# Altium schematic sheet Controller_Schematic.SchDoc
size A3; SheetNumber: 3; SheetTotal: 3
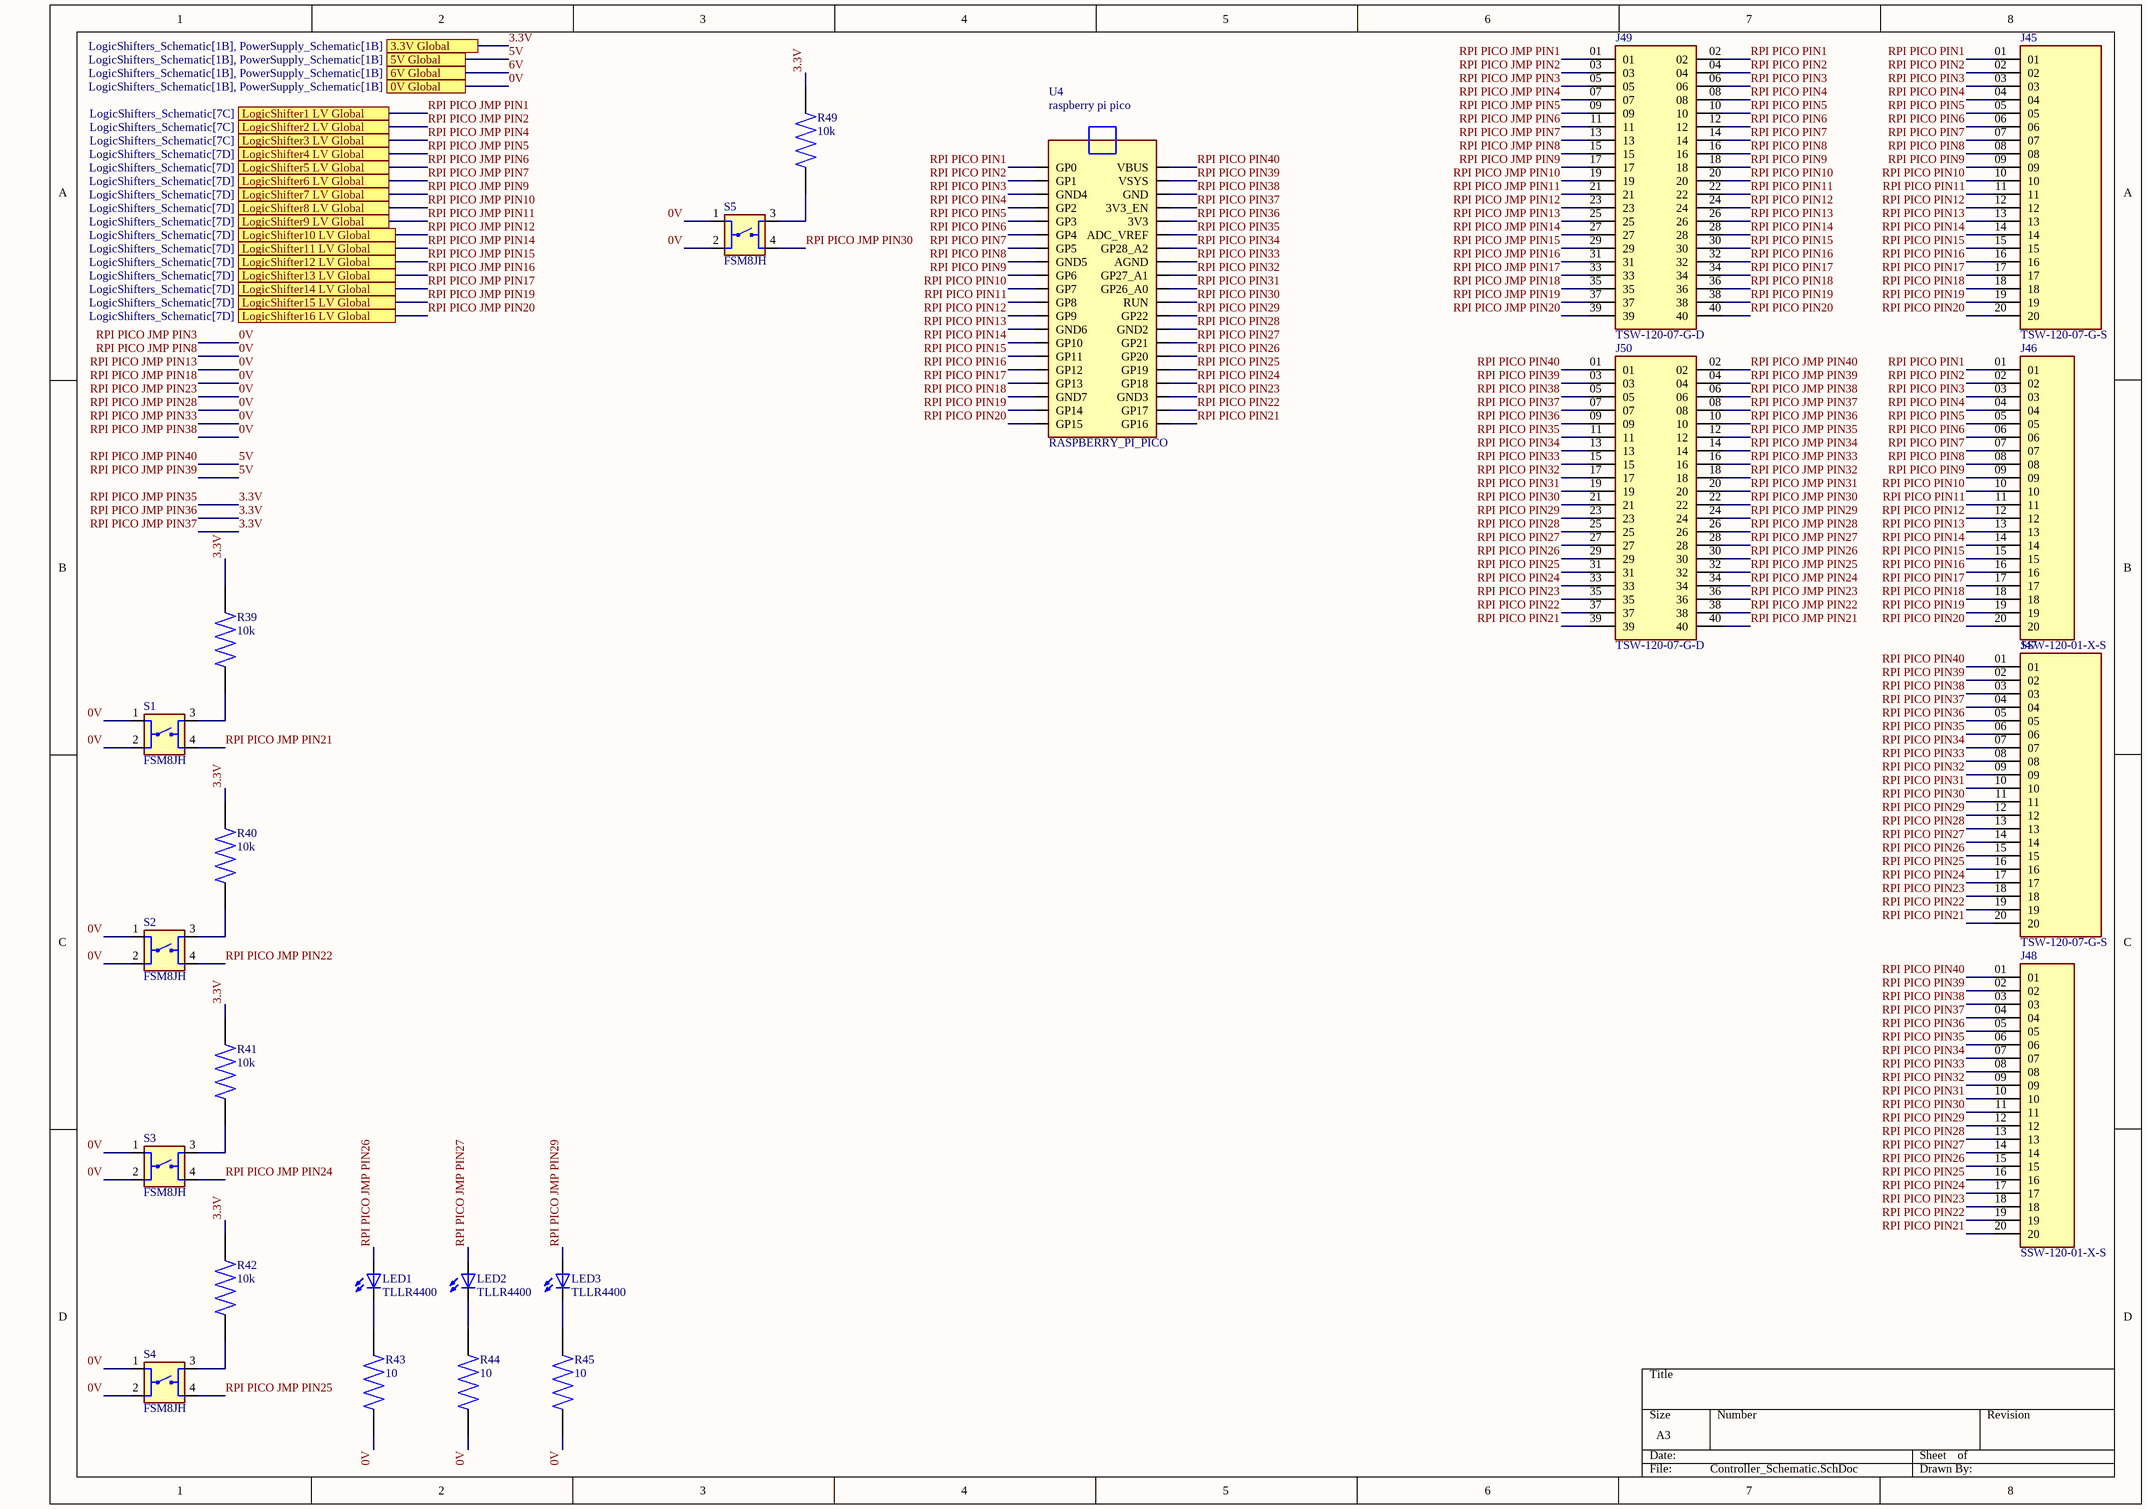
[diagram p0: Controller_Schematic.SchDoc]

## Parts
J45  TSW-120-07-G-S  [SAMTEC_TSW-120-07-G-S]
J46  SSW-120-01-X-S  [SAMTEC_SSW-120-01-X-S]
J47  TSW-120-07-G-S  [SAMTEC_TSW-120-07-G-S]
J48  SSW-120-01-X-S  [SAMTEC_SSW-120-01-X-S]
J49  TSW-120-07-G-D  [SAMTEC_TSW-120-07-G-D]
J50  TSW-120-07-G-D  [SAMTEC_TSW-120-07-G-D]
LED1  TLLR4400  [LED3MM]
LED2  TLLR4400  [LED3MM]
LED3  TLLR4400  [LED3MM]
R39  10k  [RESAD700W45L350D185]
R40  10k  [RESAD700W45L350D185]
R41  10k  [RESAD700W45L350D185]
R42  10k  [RESAD700W45L350D185]
R43  10  [RESAD700W45L350D185]
R44  10  [RESAD700W45L350D185]
R45  10  [RESAD700W45L350D185]
R49  10k  [RESAD700W45L350D185]
S1  FSM8JH  [SW_FSM8JH]
S2  FSM8JH  [SW_FSM8JH]
S3  FSM8JH  [SW_FSM8JH]
S4  FSM8JH  [SW_FSM8JH]
S5  FSM8JH  [SW_FSM8JH]
U4  RASPBERRY_PI_PICO  [RASPBERRY_PI_PICO]

## Ports
0V Global (see LogicShifters_Schematic[1B], PowerSupply_Schematic[1B]), 3.3V Global (see LogicShifters_Schematic[1B], PowerSupply_Schematic[1B]), 5V Global (see LogicShifters_Schematic[1B], PowerSupply_Schematic[1B]), 6V Global (see LogicShifters_Schematic[1B], PowerSupply_Schematic[1B]), LogicShifter1 LV Global (see LogicShifters_Schematic[7C]), LogicShifter2 LV Global (see LogicShifters_Schematic[7C]), LogicShifter3 LV Global (see LogicShifters_Schematic[7C]), LogicShifter4 LV Global (see LogicShifters_Schematic[7D]), LogicShifter5 LV Global (see LogicShifters_Schematic[7D]), LogicShifter6 LV Global (see LogicShifters_Schematic[7D]), LogicShifter7 LV Global (see LogicShifters_Schematic[7D]), LogicShifter8 LV Global (see LogicShifters_Schematic[7D]), LogicShifter9 LV Global (see LogicShifters_Schematic[7D]), LogicShifter10 LV Global (see LogicShifters_Schematic[7D]), LogicShifter11 LV Global (see LogicShifters_Schematic[7D]), LogicShifter12 LV Global (see LogicShifters_Schematic[7D]), LogicShifter13 LV Global (see LogicShifters_Schematic[7D]), LogicShifter14 LV Global (see LogicShifters_Schematic[7D]), LogicShifter15 LV Global (see LogicShifters_Schematic[7D]), LogicShifter16 LV Global (see LogicShifters_Schematic[7D])

## Nets
0V: J49.05 J49.15 J49.25 J49.35 J50.06 J50.16 J50.26 J50.36 R43.1 R44.1 R45.1 S1.1 S1.2 S2.1 S2.2 S3.1 S3.2 S4.1 S4.2 S5.1 S5.2 ; port 0V Global  [also labelled RPI PICO JMP PIN13, RPI PICO JMP PIN18, RPI PICO JMP PIN23, RPI PICO JMP PIN28, RPI PICO JMP PIN3, RPI PICO JMP PIN33, RPI PICO JMP PIN38, RPI PICO JMP PIN8]
3.3V: J50.08 J50.10 J50.12 R39.2 R40.2 R41.2 R42.2 R49.2 ; port 3.3V Global  [also labelled RPI PICO JMP PIN35, RPI PICO JMP PIN36, RPI PICO JMP PIN37]
5V: J50.02 J50.04 ; port 5V Global  [also labelled RPI PICO JMP PIN39, RPI PICO JMP PIN40]
6V: port 6V Global
RPI PICO JMP PIN1: J49.01 ; port LogicShifter1 LV Global
RPI PICO JMP PIN2: J49.03 ; port LogicShifter2 LV Global
RPI PICO JMP PIN4: J49.07 ; port LogicShifter3 LV Global
RPI PICO JMP PIN5: J49.09 ; port LogicShifter4 LV Global
RPI PICO JMP PIN6: J49.11 ; port LogicShifter5 LV Global
RPI PICO JMP PIN7: J49.13 ; port LogicShifter6 LV Global
RPI PICO JMP PIN9: J49.17 ; port LogicShifter7 LV Global
RPI PICO JMP PIN10: J49.19 ; port LogicShifter8 LV Global
RPI PICO JMP PIN11: J49.21 ; port LogicShifter9 LV Global
RPI PICO JMP PIN12: J49.23 ; port LogicShifter10 LV Global
RPI PICO JMP PIN14: J49.27 ; port LogicShifter11 LV Global
RPI PICO JMP PIN15: J49.29 ; port LogicShifter12 LV Global
RPI PICO JMP PIN16: J49.31 ; port LogicShifter13 LV Global
RPI PICO JMP PIN17: J49.33 ; port LogicShifter14 LV Global
RPI PICO JMP PIN19: J49.37 ; port LogicShifter15 LV Global
RPI PICO JMP PIN20: J49.39 ; port LogicShifter16 LV Global
RPI PICO JMP PIN21: J50.40 S1.4
RPI PICO JMP PIN22: J50.38 S2.4
RPI PICO JMP PIN24: J50.34 S3.4
RPI PICO JMP PIN25: J50.32 S4.4
RPI PICO JMP PIN26: J50.30 LED1.A
RPI PICO JMP PIN27: J50.28 LED2.A
RPI PICO JMP PIN29: J50.24 LED3.A
RPI PICO JMP PIN30: J50.22 S5.4
RPI PICO JMP PIN31: J50.20
RPI PICO JMP PIN32: J50.18
RPI PICO JMP PIN34: J50.14
RPI PICO PIN1: J45.01 J46.01 J49.02 U4.GP0
RPI PICO PIN2: J45.02 J46.02 J49.04 U4.GP1
RPI PICO PIN3: J45.03 J46.03 J49.06 U4.GND4
RPI PICO PIN4: J45.04 J46.04 J49.08 U4.GP2
RPI PICO PIN5: J45.05 J46.05 J49.10 U4.GP3
RPI PICO PIN6: J45.06 J46.06 J49.12 U4.GP4
RPI PICO PIN7: J45.07 J46.07 J49.14 U4.GP5
RPI PICO PIN8: J45.08 J46.08 J49.16 U4.GND5
RPI PICO PIN9: J45.09 J46.09 J49.18 U4.GP6
RPI PICO PIN10: J45.10 J46.10 J49.20 U4.GP7
RPI PICO PIN11: J45.11 J46.11 J49.22 U4.GP8
RPI PICO PIN12: J45.12 J46.12 J49.24 U4.GP9
RPI PICO PIN13: J45.13 J46.13 J49.26 U4.GND6
RPI PICO PIN14: J45.14 J46.14 J49.28 U4.GP10
RPI PICO PIN15: J45.15 J46.15 J49.30 U4.GP11
RPI PICO PIN16: J45.16 J46.16 J49.32 U4.GP12
RPI PICO PIN17: J45.17 J46.17 J49.34 U4.GP13
RPI PICO PIN18: J45.18 J46.18 J49.36 U4.GND7
RPI PICO PIN19: J45.19 J46.19 J49.38 U4.GP14
RPI PICO PIN20: J45.20 J46.20 J49.40 U4.GP15
RPI PICO PIN21: J47.20 J48.20 J50.39 U4.GP16
RPI PICO PIN22: J47.19 J48.19 J50.37 U4.GP17
RPI PICO PIN23: J47.18 J48.18 J50.35 U4.GND3
RPI PICO PIN24: J47.17 J48.17 J50.33 U4.GP18
RPI PICO PIN25: J47.16 J48.16 J50.31 U4.GP19
RPI PICO PIN26: J47.15 J48.15 J50.29 U4.GP20
RPI PICO PIN27: J47.14 J48.14 J50.27 U4.GP21
RPI PICO PIN28: J47.13 J48.13 J50.25 U4.GND2
RPI PICO PIN29: J47.12 J48.12 J50.23 U4.GP22
RPI PICO PIN30: J47.11 J48.11 J50.21 U4.RUN
RPI PICO PIN31: J47.10 J48.10 J50.19 U4.GP26_A0
RPI PICO PIN32: J47.09 J48.09 J50.17 U4.GP27_A1
RPI PICO PIN33: J47.08 J48.08 J50.15 U4.AGND
RPI PICO PIN34: J47.07 J48.07 J50.13 U4.GP28_A2
RPI PICO PIN35: J47.06 J48.06 J50.11 U4.ADC_VREF
RPI PICO PIN36: J47.05 J48.05 J50.09 U4.3V3
RPI PICO PIN37: J47.04 J48.04 J50.07 U4.3V3_EN
RPI PICO PIN38: J47.03 J48.03 J50.05 U4.GND
RPI PICO PIN39: J47.02 J48.02 J50.03 U4.VSYS
RPI PICO PIN40: J47.01 J48.01 J50.01 U4.VBUS
NetLED1_K: LED1.K(C) R43.2
NetLED2_K: LED2.K(C) R44.2
NetLED3_K: LED3.K(C) R45.2
NetR39_1: R39.1 S1.3
NetR40_1: R40.1 S2.3
NetR41_1: R41.1 S3.3
NetR42_1: R42.1 S4.3
NetR49_1: R49.1 S5.3

## Notes on the sheet
- (in symbol RASPBERRY_PI_PICO) raspberry pi pico

## Library data of the parts
J45 J47 = TSW-120-07-G-S: MF: Samtec; Package: None; MP: TSW-120-07-G-S; Price: None; Value: *; Availability: Unavailable
J46 J48 = SSW-120-01-X-S: SSW - Samtec 2.54mm Single Row Straight Socket Strip 8.5 Profile - Fast Stock; MP: SSW-120-01-G-S; SnapEDA_Link: https://www.snapeda.com/parts/SSW-120-01-G-S/Samtec/view-part/?ref=snap; Package: None; Value: *; MF: Samtec; Check_prices: https://www.snapeda.com/parts/SSW-120-01-G-S/Samtec/view-part/?ref=eda
J49 J50 = TSW-120-07-G-D: MF: Samtec; Price: None; Value: *; Availability: Unavailable; MP: TSW-120-07-G-D; Package: None
LED1-LED3 = TLLR4400: Red 619nm LED Indication - Discrete 1.9V Radial; MF: Vishay; SnapEDA_Link: https://www.snapeda.com/parts/TLLR4400/Vishay+Semiconductor+Opto+Division/view-part/?ref=snap; Package: None; Value: *; MP: TLLR4400; Check_prices: https://www.snapeda.com/parts/TLLR4400/Vishay+Semiconductor+Opto+Division/view-part/?ref=eda
R39-R45 R49 = 3-1623927-1: 1 MOhms Â±5% 0.25W, 1/4W Through Hole Resistor Axial - Carbon Film; MF: TE Connectivity; SnapEDA_Link: https://www.snapeda.com/parts/3-1623927-1/TE+Connectivity/view-part/?ref=snap; Package: None; Value: *; MP: 3-1623927-1; Check_prices: https://www.snapeda.com/parts/3-1623927-1/TE+Connectivity/view-part/?ref=eda
S1-S5 = FSM8JH: Tactile Switch SPST-NO Top Actuated Through Hole; MF: TE Connectivity; Check_prices: https://www.snapeda.com/parts/FSM8JH/TE+Connectivity+ALCOSWITCH+Switches/view-part/?ref=eda; Value: *; Availability: In Stock; MP: FSM8JH; Price: None; Package: None; SnapEDA_Link: https://www.snapeda.com/parts/FSM8JH/TE+Connectivity+ALCOSWITCH+Switches/view-part/?ref=snap
U4 = RASPBERRY_PI_PICO: Raspberry Pi Board, Arm Cortex-M0+; Core Architecture:Arm; Core Sub-Architecture:Cortex-M0+; Kit Contents:Raspberry Pi Pico Board; No. Of Bits:32Bit; Silicon Core Number:Rp2040; Silicon Manufacturer:Raspberry Pi |Raspberry-Pi RASPBERRY PI PICO; SnapEDA_Link: https://www.snapeda.com/parts/RASPBERRY%20PI%20PICO/Raspberry+Pi/view-part/?ref=snap; Package: None; Value: *; MF: Raspberry Pi; MP: RASPBERRY PI PICO; Check_prices: https://www.snapeda.com/parts/RASPBERRY%20PI%20PICO/Raspberry+Pi/view-part/?ref=eda